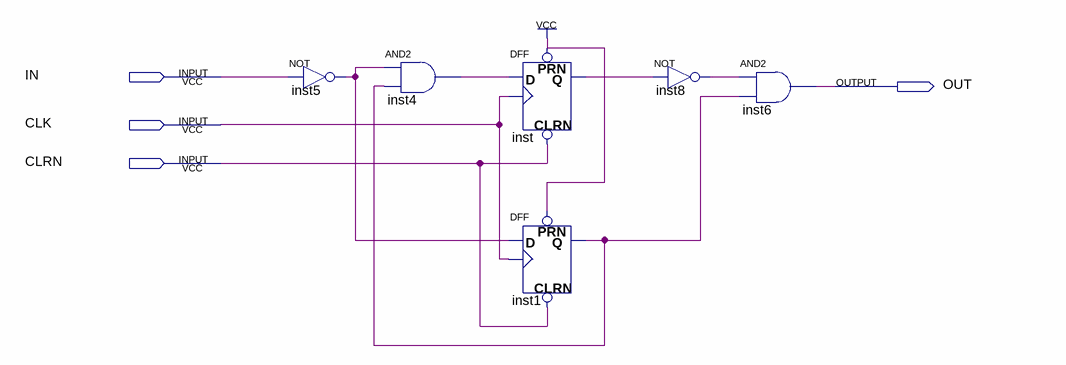
[diagram p0: schematic sheet]
// Quartus schematic edge_det.bdf as structural Verilog: 6 symbols, 4 pins
module edge_det (
  input  IN,
  input  CLK,
  input  CLRN,
  output OUT
);

  wire inst1_q, inst4_out, inst5_out, inst8_out, inst_q;

  not inst5 (inst5_out, IN);
  and inst4 (inst4_out, inst5_out, inst1_q);
  DFF inst (.CLRN(CLRN), .CLK(CLK), .D(inst4_out), .PRN(1'b1), .Q(inst_q));
  DFF inst1 (.CLRN(CLRN), .CLK(CLK), .D(inst5_out), .PRN(1'b1), .Q(inst1_q));
  not inst8 (inst8_out, inst_q);
  and inst6 (OUT, inst8_out, inst1_q);
endmodule
